# Altium schematic sheet LED.SchDoc
size A4
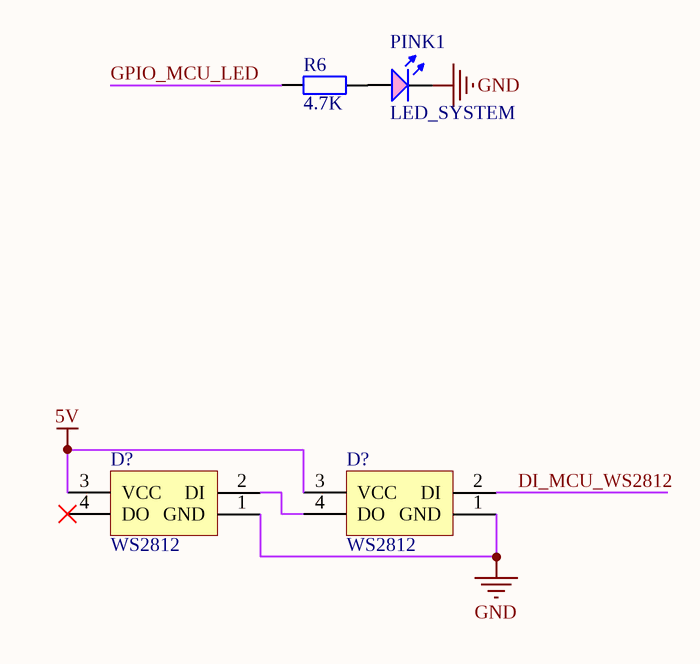
[diagram p0: LED.SchDoc]

## Parts
(Parts that share a designator on the sheet are numbered #1, #2 ... from top to bottom, then left to right.)
D?#1  WS2812  [RGB_LED_1206]
D?#2  WS2812  [RGB_LED_1206]
PINK1  LED_SYSTEM  [LED_0603_R]
R6  4.7K  [Res-0603]

## Nets
5V: D?#1.3(VCC) D?#2.3(VCC)
GND: D?#1.1(GND) D?#2.1(GND) PINK1.2(K)
DI_MCU_WS2812: D?#2.2(DI)
GPIO_MCU_LED: R6.2
NetD?#1_2: D?#1.2(DI) D?#2.4(DO)
NetPINK1_1: PINK1.1(A) R6.1

Not connected (* = marked no-connect by the designer): D?#1 4(DO)*

## Notes on the sheet
- Title
- Size:
- Date:
- A4
- Number:
- Time:
- Revision:
- Sheet
- of
- File:

## Library data of the parts
PINK1 = LED_SMD_PINK: 发光二极管; ComponentLink1Description: 供应商链接; ComponentLink1URL: http://www.szlcsc.com/product/details_2659.html; Package: 0603; Supplier: LC; SuppliersPartNumber: C2286
R6 = RES: 贴片电阻
D?#1 D?#2 = WS2812: Publisher: mazhongwei; Published: 8-August-2017; PackageReference: RGB_LED_5050